# Altium schematic sheet 4_Connectors.SchDoc
size A4; SheetNumber: 6; SheetTotal: 7
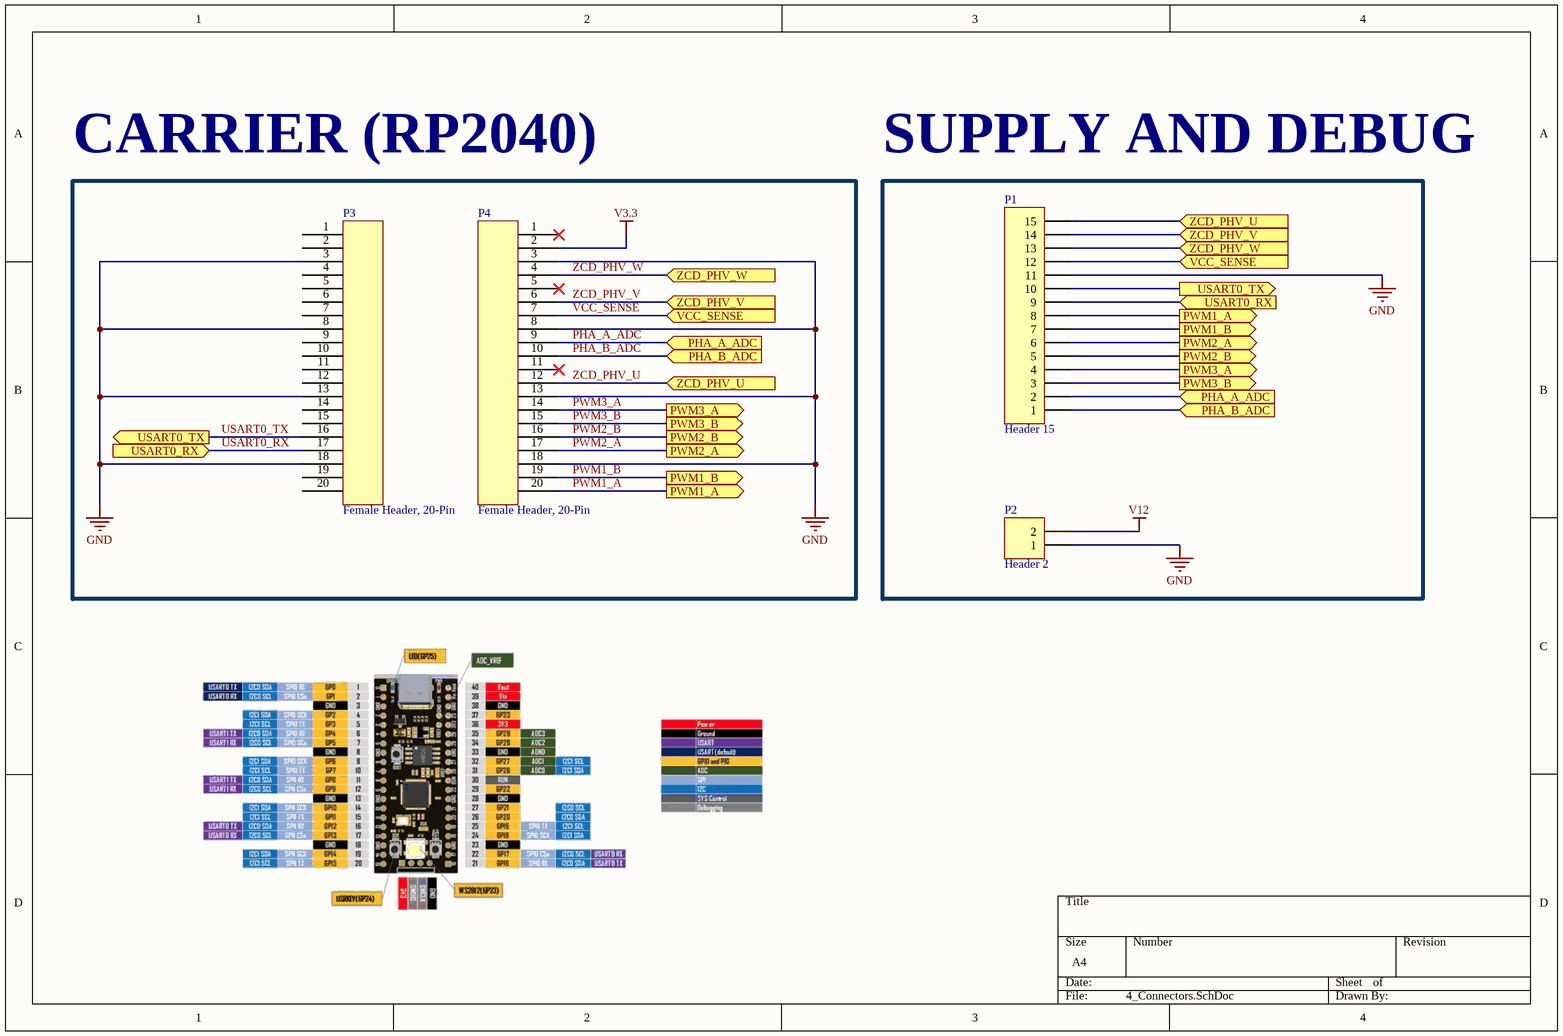
[diagram p0: 4_Connectors.SchDoc]

## Parts
P1  Header 15  [HDR1X15]
P2  Header 2  [Screw Header 2 (5 mm pitch)]
P3  Female Header, 20-Pin  [HEADER 20]
P4  Female Header, 20-Pin  [HEADER 20]

## Blocks framed on the sheet
CARRIER (RP2040): P3 P4
SUPPLY AND DEBUG: P1 P2

## Ports
PHA_A_ADC (in), PHA_B_ADC (in), PWM1_A (out), PWM1_B (out), PWM2_A (out), PWM2_B (out), PWM3_A (out), PWM3_B (out), USART0_RX (in), USART0_TX (out), VCC_SENSE (in), ZCD_PHV_U (in), ZCD_PHV_V (in), ZCD_PHV_W (in)

## Nets
GND: P1.11 P2.1 P3.3 P3.8 P3.13 P3.18 P4.3 P4.8 P4.13 P4.18
V3.3: P4.2
V12: P2.2
PHA_A_ADC: P1.2 P4.9 ; port PHA_A_ADC
PHA_B_ADC: P1.1 P4.10 ; port PHA_B_ADC
PWM1_A: P1.8 P4.20 ; port PWM1_A
PWM1_B: P1.7 P4.19 ; port PWM1_B
PWM2_A: P1.6 P4.17 ; port PWM2_A
PWM2_B: P1.5 P4.16 ; port PWM2_B
PWM3_A: P1.4 P4.14 ; port PWM3_A
PWM3_B: P1.3 P4.15 ; port PWM3_B
USART0_RX: P1.9 P3.17 ; port USART0_RX
USART0_TX: P1.10 P3.16 ; port USART0_TX
VCC_SENSE: P1.12 P4.7 ; port VCC_SENSE
ZCD_PHV_U: P1.15 P4.12 ; port ZCD_PHV_U
ZCD_PHV_V: P1.14 P4.6 ; port ZCD_PHV_V
ZCD_PHV_W: P1.13 P4.4 ; port ZCD_PHV_W

Not connected (* = marked no-connect by the designer): P3 1 2 4 5 6 7 9 10 11 12 14 15 19 20; P4 1* 5* 11*

## Library data of the parts
P1 = Header 15: Header, 15-Pin; LatestRevisionDate: 17-Jul-2002; LatestRevisionNote: Re-released for DXP Platform.; Publisher: Altium Limited
P2 = Header 2: Header, 2-Pin; LatestRevisionDate: 17-Jul-2002; LatestRevisionNote: Re-released for DXP Platform.; Publisher: Altium Limited
P3 P4 = Header 20